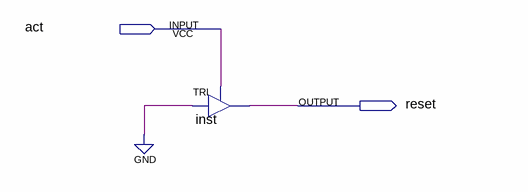
[diagram p0: schematic sheet]
// Quartus schematic reset.bdf as structural Verilog: 1 symbols, 2 pins
module reset (
  input  act,
  output reset
);

  TRI inst (.IN(1'b0), .OE(act), .OUT(reset));
endmodule
